# Altium schematic sheet Generation.SchDoc
size A4
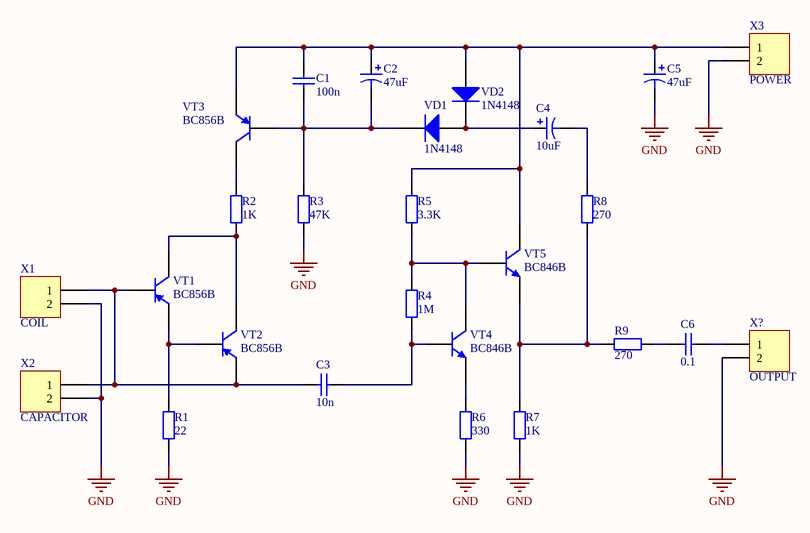
[diagram p0: Generation.SchDoc]

## Parts
C1  100n  [0805]
C2  47uF  [RB7.6-15]
C3  10n  [0805]
C4  10uF  [RB7.6-15]
C5  47uF  [RB7.6-15]
C6  0.1  [0805]
R1  22  [1206_SMD_Resistor]
R2  1K  [1206_SMD_Resistor]
R3  47K  [1206_SMD_Resistor]
R4  1M  [1206_SMD_Resistor]
R5  3.3K  [1206_SMD_Resistor]
R6  330  [1206_SMD_Resistor]
R7  1K  [1206_SMD_Resistor]
R8  270  [1206_SMD_Resistor]
R9  270  [1206_SMD_Resistor]
VD1  1N4148  [SOD-323]
VD2  1N4148  [SOD-323]
VT1  BC856B  [SOT23_N]
VT2  BC856B  [SOT23_N]
VT3  BC856B  [SOT23_N]
VT4  BC846B  [SOT23_N]
VT5  BC846B  [SOT23_N]
X1  COIL  [HDR1X2]
X2  CAPACITOR  [HDR1X2]
X3  POWER  [HDR1X2]
X?  OUTPUT  [HDR1X2]

## Nets
GND: C5.2 R1.1 R3.1 R6.1 R7.1 X1.2 X2.2 X3.2 X?.2
NetC1_1: C1.1 C2.2 R3.2 VD1.2(K) VT3.1(B)
NetC1_2: C1.2 C2.1 C5.1 R5.2 VD2.1(A) VT3.2(E) VT5.3(C) X3.1
NetC3_1: C3.1 VT1.1(B) VT2.2(E) X1.1 X2.1
NetC3_2: C3.2 R4.1 VT4.1(B)
NetC4_1: C4.1 VD1.1(A) VD2.2(K)
NetC4_2: C4.2 R8.2
NetC6_1: C6.1 R9.2
NetC6_2: C6.2 X?.1
NetR1_2: R1.2 VT1.2(E) VT2.1(B)
NetR2_1: R2.1 VT1.3(C) VT2.3(C)
NetR2_2: R2.2 VT3.3(C)
NetR4_2: R4.2 R5.1 VT4.3(C) VT5.1(B)
NetR6_2: R6.2 VT4.2(E)
NetR7_2: R7.2 R8.1 R9.1 VT5.2(E)

## Library data of the parts
C1 C3 C6 = Capacitor SMD: Capacitor; Published: 8-Jun-2000; LatestRevisionDate: 17-Jul-2002; LatestRevisionNote: Re-released for DXP Platform.; PackageReference: RAD-0.3; Publisher: Altium Limited
  C1: Value: 100n
  C3: Value: 10n
  C6: Value: 0.1
C2 C4 C5 = Cap Pol1: Polarized Capacitor (Radial); Published: 8-Jun-2000; LatestRevisionDate: 17-Jul-2002; LatestRevisionNote: Re-released for DXP Platform.; PackageReference: RB7.6-15; Publisher: Altium Limited; PackageDescription: Polarized Capacitor (Radial); 2 Leads
  C2 C5: Value: 47uF
  C4: Value: 10uF
R1-R9 = Resistor: Published: 31-Aug-2014; Publisher: Dmitry Kuzmin
  R1: Value: 22
  R2 R7: Value: 1K
  R3: Value: 47K
  R4: Value: 1M
  R5: Value: 3.3K
  R6: Value: 330
  R8 R9: Value: 270
VD1 VD2 = 1N4148: High Conductance Fast Diode; Published: 8-Jun-2000; LatestRevisionDate: 17-Jul-2002; LatestRevisionNote: Re-released for DXP Platform.; DatasheetDocument: 1997; PackageReference: DO-35; Publisher: Altium Limited; Code_JEDEC: DO-204-AH; ComponentLink1Description: Manufacturer Link; ComponentLink1URL: http://www.fairchildsemi.com/; ComponentLink2Description: Datasheet; ComponentLink2URL: http://www.fairchildsemi.com/ds/1N%2F1N4148.pdf
VT1-VT3 = BC856B: PNP Bipolar Transistor; Published: 8-Jun-2000; LatestRevisionDate: 29-May-2009; LatestRevisionNote: IPC-7351 Footprint Added.; PackageVersion: Aug-1999; PackageReference: SOT-23B; Publisher: Altium Limited; PackageDescription: 3-Pin SOT-23 Package 0.95 mm Pitch, 2.4 mm Lead Span
VT4 VT5 = BC846B: NPN General-purpose Transistor; Published: 17-Sep-2003; LatestRevisionDate: 12-Dec-2006; LatestRevisionNote: IPC-7351 Footprint Added.; DatasheetVersion: 4-Feb-2002; PackageVersion: May-1999; PackageReference: SOT23; Publisher: Altium Limited; PackageDescription: 3-Pin SOT-23 Package 0.95 mm Pitch, 2.3 mm Lead Span; ComponentLink1Description: Manufacturer Link; ComponentLink1URL: http://www.semiconductors.philips.com/; ComponentLink2Description: Datasheet; ComponentLink2URL: http://www.semiconductors.philips.com/acrobat/datasheets/BC846_BC847_BC848_5.pdf
X1-X3 X? = Header 2: Header, 2-Pin; LatestRevisionDate: 17-Jul-2002; LatestRevisionNote: Re-released for DXP Platform.; Publisher: Altium Limited